# EAGLE design AMS Enerdel Adapter rev7 (EAGLE 9.6.2)
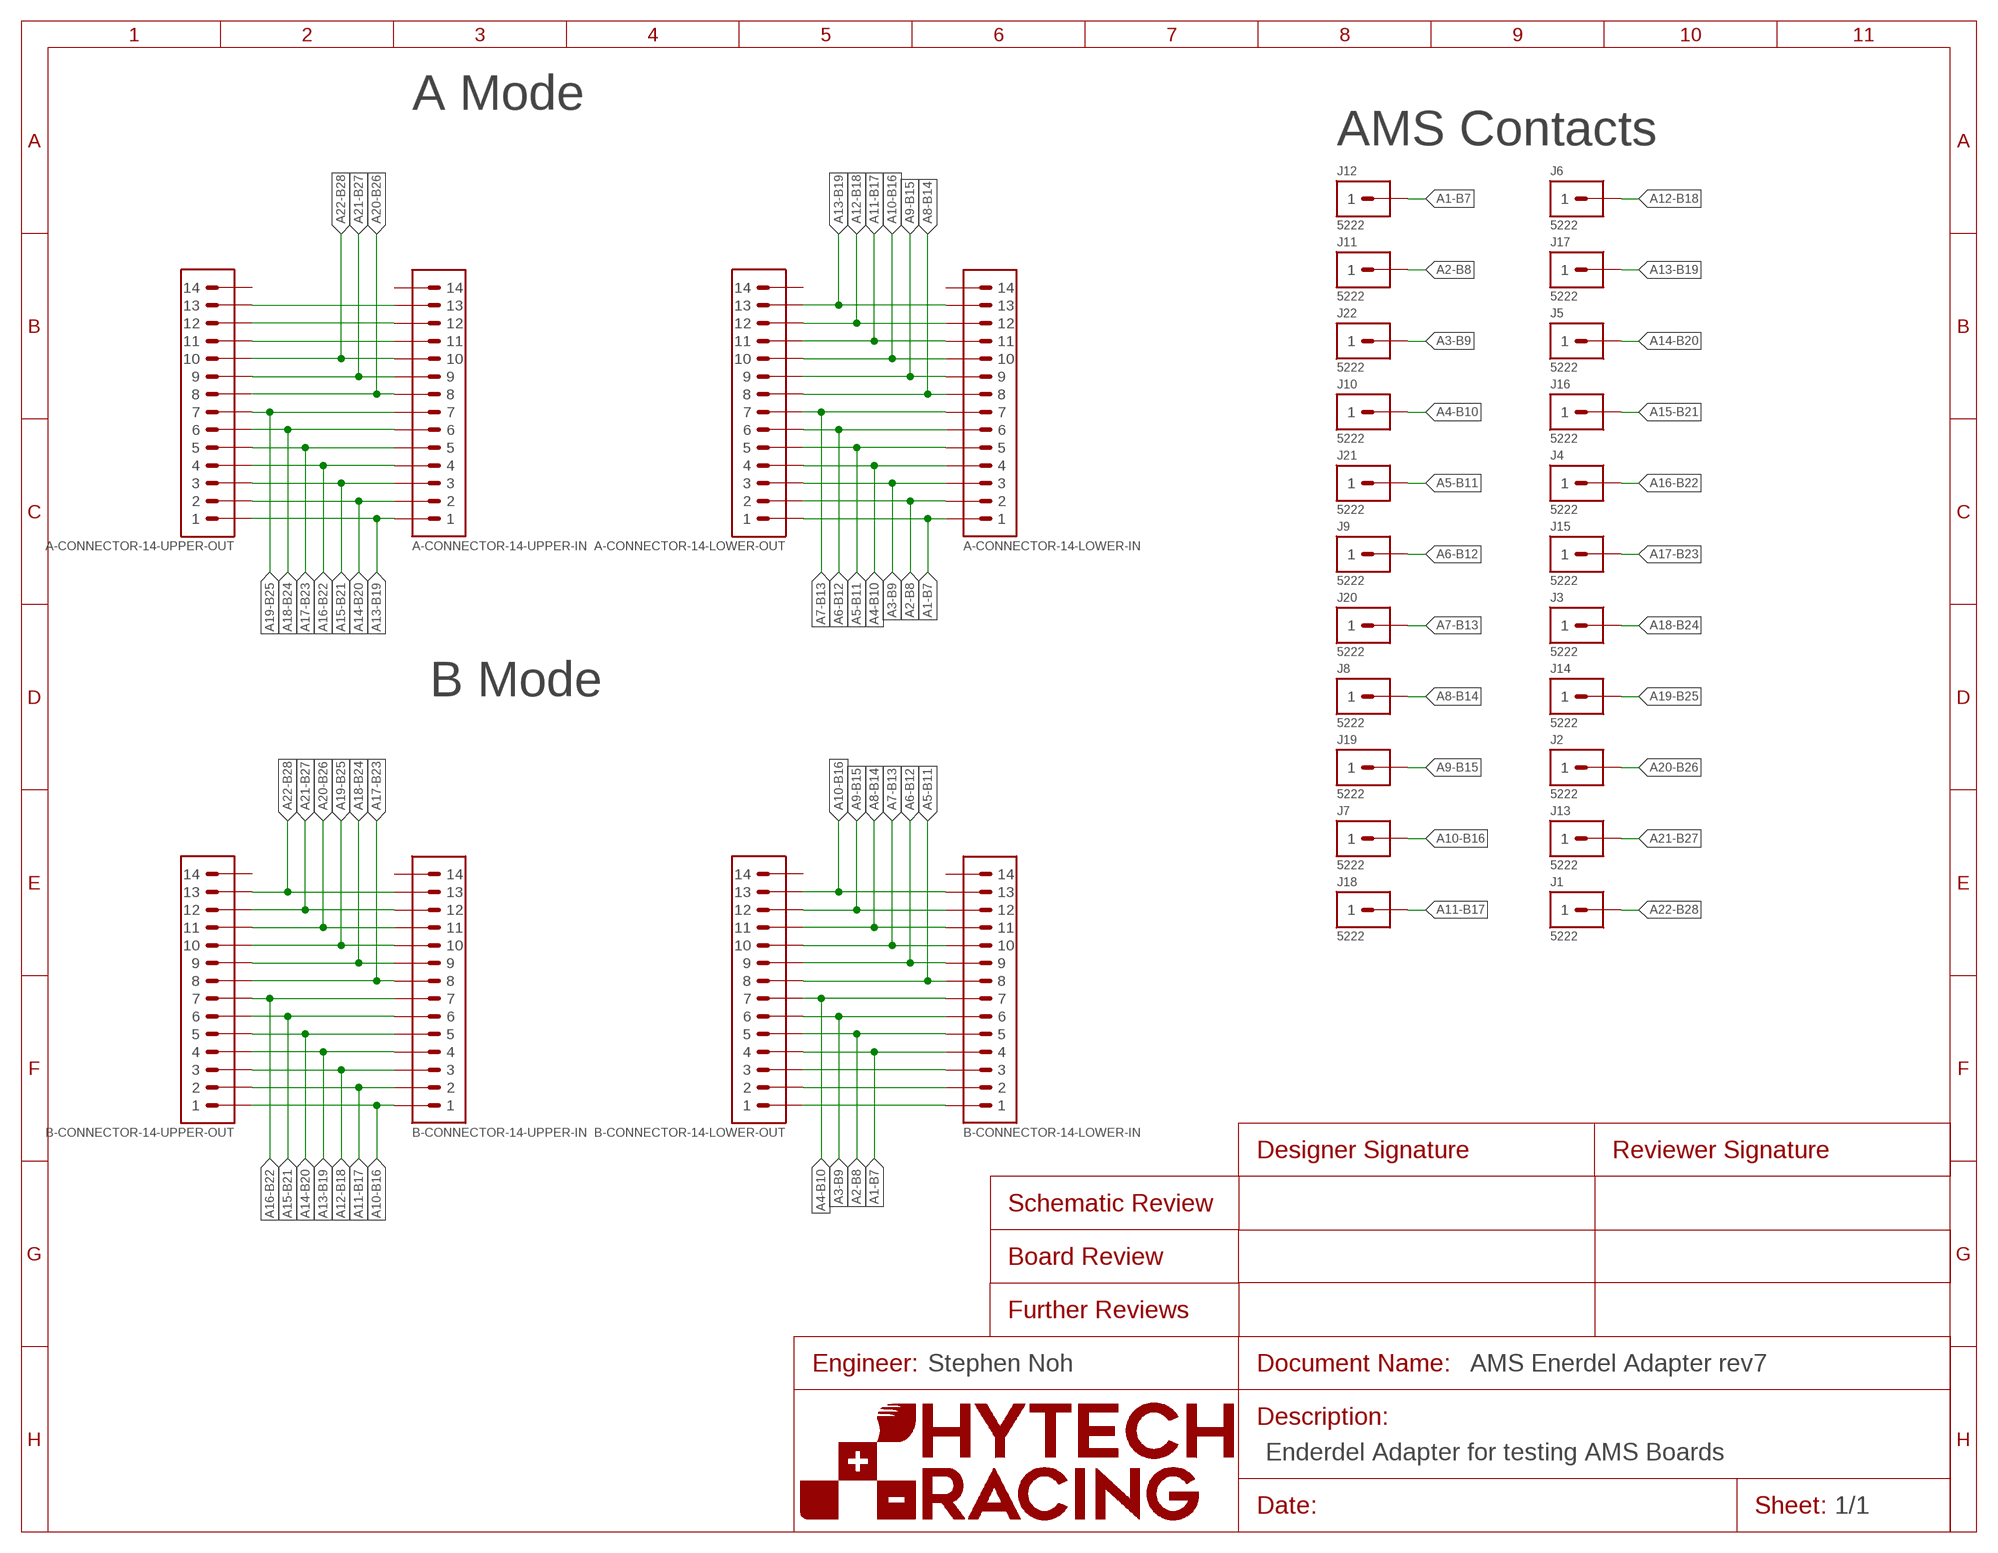
[diagram p0: schematic, sheet 1]

## Parts
A-CONNECTOR-14-LOWER-IN  CONNECTOR-14_MINIFIT_  [MOLEX_MINIFIT_PTH_14]
A-CONNECTOR-14-LOWER-OUT  CONNECTOR-14_MINIFIT_  [MOLEX_MINIFIT_PTH_14]
A-CONNECTOR-14-UPPER-IN  CONNECTOR-14_NANOFIT_  [MOLEX_NANOFIT_PTH_14]
A-CONNECTOR-14-UPPER-OUT  CONNECTOR-14_NANOFIT_  [MOLEX_NANOFIT_PTH_14]
B-CONNECTOR-14-LOWER-IN  CONNECTOR-14_MINIFIT_  [MOLEX_MINIFIT_PTH_14]
B-CONNECTOR-14-LOWER-OUT  CONNECTOR-14_MINIFIT_  [MOLEX_MINIFIT_PTH_14]
B-CONNECTOR-14-UPPER-IN  CONNECTOR-14_NANOFIT_  [MOLEX_NANOFIT_PTH_14]
B-CONNECTOR-14-UPPER-OUT  CONNECTOR-14_NANOFIT_  [MOLEX_NANOFIT_PTH_14]
J1  CONNECTOR-1_5222_  [5222]
J2  CONNECTOR-1_5222_  [5222]
J3  CONNECTOR-1_5222_  [5222]
J4  CONNECTOR-1_5222_  [5222]
J5  CONNECTOR-1_5222_  [5222]
J6  CONNECTOR-1_5222_  [5222]
J7  CONNECTOR-1_5222_  [5222]
J8  CONNECTOR-1_5222_  [5222]
J9  CONNECTOR-1_5222_  [5222]
J10  CONNECTOR-1_5222_  [5222]
J11  CONNECTOR-1_5222_  [5222]
J12  CONNECTOR-1_5222_  [5222]
J13  CONNECTOR-1_5222_  [5222]
J14  CONNECTOR-1_5222_  [5222]
J15  CONNECTOR-1_5222_  [5222]
J16  CONNECTOR-1_5222_  [5222]
J17  CONNECTOR-1_5222_  [5222]
J18  CONNECTOR-1_5222_  [5222]
J19  CONNECTOR-1_5222_  [5222]
J20  CONNECTOR-1_5222_  [5222]
J21  CONNECTOR-1_5222_  [5222]
J22  CONNECTOR-1_5222_  [5222]

## Nets
A1-B7: A-CONNECTOR-14-LOWER-IN.1 A-CONNECTOR-14-LOWER-OUT.1 B-CONNECTOR-14-LOWER-IN.4 B-CONNECTOR-14-LOWER-OUT.4 J12.1
A2-B8: A-CONNECTOR-14-LOWER-IN.2 A-CONNECTOR-14-LOWER-OUT.2 B-CONNECTOR-14-LOWER-IN.5 B-CONNECTOR-14-LOWER-OUT.5 J11.1
A3-B9: A-CONNECTOR-14-LOWER-IN.3 A-CONNECTOR-14-LOWER-OUT.3 B-CONNECTOR-14-LOWER-IN.6 B-CONNECTOR-14-LOWER-OUT.6 J22.1
A4-B10: A-CONNECTOR-14-LOWER-IN.4 A-CONNECTOR-14-LOWER-OUT.4 B-CONNECTOR-14-LOWER-IN.7 B-CONNECTOR-14-LOWER-OUT.7 J10.1
A5-B11: A-CONNECTOR-14-LOWER-IN.5 A-CONNECTOR-14-LOWER-OUT.5 B-CONNECTOR-14-LOWER-IN.8 B-CONNECTOR-14-LOWER-OUT.8 J21.1
A6-B12: A-CONNECTOR-14-LOWER-IN.6 A-CONNECTOR-14-LOWER-OUT.6 B-CONNECTOR-14-LOWER-IN.9 B-CONNECTOR-14-LOWER-OUT.9 J9.1
A7-B13: A-CONNECTOR-14-LOWER-IN.7 A-CONNECTOR-14-LOWER-OUT.7 B-CONNECTOR-14-LOWER-IN.10 B-CONNECTOR-14-LOWER-OUT.10 J20.1
A8-B14: A-CONNECTOR-14-LOWER-IN.8 A-CONNECTOR-14-LOWER-OUT.8 B-CONNECTOR-14-LOWER-IN.11 B-CONNECTOR-14-LOWER-OUT.11 J8.1
A9-B15: A-CONNECTOR-14-LOWER-IN.9 A-CONNECTOR-14-LOWER-OUT.9 B-CONNECTOR-14-LOWER-IN.12 B-CONNECTOR-14-LOWER-OUT.12 J19.1
A10-B16: A-CONNECTOR-14-LOWER-IN.10 A-CONNECTOR-14-LOWER-OUT.10 B-CONNECTOR-14-LOWER-IN.13 B-CONNECTOR-14-LOWER-OUT.13 B-CONNECTOR-14-UPPER-IN.1 B-CONNECTOR-14-UPPER-OUT.1 J7.1
A11-B17: A-CONNECTOR-14-LOWER-IN.11 A-CONNECTOR-14-LOWER-OUT.11 B-CONNECTOR-14-UPPER-IN.2 B-CONNECTOR-14-UPPER-OUT.2 J18.1
A12-B18: A-CONNECTOR-14-LOWER-IN.12 A-CONNECTOR-14-LOWER-OUT.12 B-CONNECTOR-14-UPPER-IN.3 B-CONNECTOR-14-UPPER-OUT.3 J6.1
A13-B19: A-CONNECTOR-14-LOWER-IN.13 A-CONNECTOR-14-LOWER-OUT.13 A-CONNECTOR-14-UPPER-IN.1 A-CONNECTOR-14-UPPER-OUT.1 B-CONNECTOR-14-UPPER-IN.4 B-CONNECTOR-14-UPPER-OUT.4 J17.1
A14-B20: A-CONNECTOR-14-UPPER-IN.2 A-CONNECTOR-14-UPPER-OUT.2 B-CONNECTOR-14-UPPER-IN.5 B-CONNECTOR-14-UPPER-OUT.5 J5.1
A15-B21: A-CONNECTOR-14-UPPER-IN.3 A-CONNECTOR-14-UPPER-OUT.3 B-CONNECTOR-14-UPPER-IN.6 B-CONNECTOR-14-UPPER-OUT.6 J16.1
A16-B22: A-CONNECTOR-14-UPPER-IN.4 A-CONNECTOR-14-UPPER-OUT.4 B-CONNECTOR-14-UPPER-IN.7 B-CONNECTOR-14-UPPER-OUT.7 J4.1
A17-B23: A-CONNECTOR-14-UPPER-IN.5 A-CONNECTOR-14-UPPER-OUT.5 B-CONNECTOR-14-UPPER-IN.8 B-CONNECTOR-14-UPPER-OUT.8 J15.1
A18-B24: A-CONNECTOR-14-UPPER-IN.6 A-CONNECTOR-14-UPPER-OUT.6 B-CONNECTOR-14-UPPER-IN.9 B-CONNECTOR-14-UPPER-OUT.9 J3.1
A19-B25: A-CONNECTOR-14-UPPER-IN.7 A-CONNECTOR-14-UPPER-OUT.7 B-CONNECTOR-14-UPPER-IN.10 B-CONNECTOR-14-UPPER-OUT.10 J14.1
A20-B26: A-CONNECTOR-14-UPPER-IN.8 A-CONNECTOR-14-UPPER-OUT.8 B-CONNECTOR-14-UPPER-IN.11 B-CONNECTOR-14-UPPER-OUT.11 J2.1
A21-B27: A-CONNECTOR-14-UPPER-IN.9 A-CONNECTOR-14-UPPER-OUT.9 B-CONNECTOR-14-UPPER-IN.12 B-CONNECTOR-14-UPPER-OUT.12 J13.1
A22-B28: A-CONNECTOR-14-UPPER-IN.10 A-CONNECTOR-14-UPPER-OUT.10 B-CONNECTOR-14-UPPER-IN.13 B-CONNECTOR-14-UPPER-OUT.13 J1.1
B-PASS1: B-CONNECTOR-14-LOWER-IN.3 B-CONNECTOR-14-LOWER-OUT.3
B-PASS2: B-CONNECTOR-14-LOWER-IN.2 B-CONNECTOR-14-LOWER-OUT.2
B-PASS3: B-CONNECTOR-14-LOWER-IN.1 B-CONNECTOR-14-LOWER-OUT.1
N$5: A-CONNECTOR-14-UPPER-IN.11 A-CONNECTOR-14-UPPER-OUT.11
N$6: A-CONNECTOR-14-UPPER-IN.12 A-CONNECTOR-14-UPPER-OUT.12
N$7: A-CONNECTOR-14-UPPER-IN.13 A-CONNECTOR-14-UPPER-OUT.13
Unconnected: A-CONNECTOR-14-LOWER-IN.14 A-CONNECTOR-14-LOWER-OUT.14 A-CONNECTOR-14-UPPER-IN.14 A-CONNECTOR-14-UPPER-OUT.14 B-CONNECTOR-14-LOWER-IN.14 B-CONNECTOR-14-LOWER-OUT.14 B-CONNECTOR-14-UPPER-IN.14 B-CONNECTOR-14-UPPER-OUT.14

## Notes on the sheet
- A Mode
- AMS Contacts
- B Mode
- Stephen Noh
- Enderdel Adapter for testing AMS Boards

## Library data of the parts
A-CONNECTOR-14-LOWER-IN A-CONNECTOR-14-LOWER-OUT A-CONNECTOR-14-UPPER-IN A-CONNECTOR-14-UPPER-OUT B-CONNECTOR-14-LOWER-IN B-CONNECTOR-14-LOWER-OUT B-CONNECTOR-14-UPPER-IN B-CONNECTOR-14-UPPER-OUT = HyTechDevices:CONNECTOR-14_?_*
J1-J22 = HyTechDevices:CONNECTOR-1_?_*: 1 Pin Connector Pogo pin datasheet <https://www.mouser.com/datasheet/2/273/Mill-Max_03212019_807-22-001-10-020101-1545127.pdf> 5222 Spring datasheet <https://www.mouser.com/datasheet/2/215/5222-743174.pdf>; DKPN: 36-5222-ND; MANUFACTURER: Keystone Electronics; MODEL: SPRING; MOPN: 534-5222; MPN: 5222

## Board
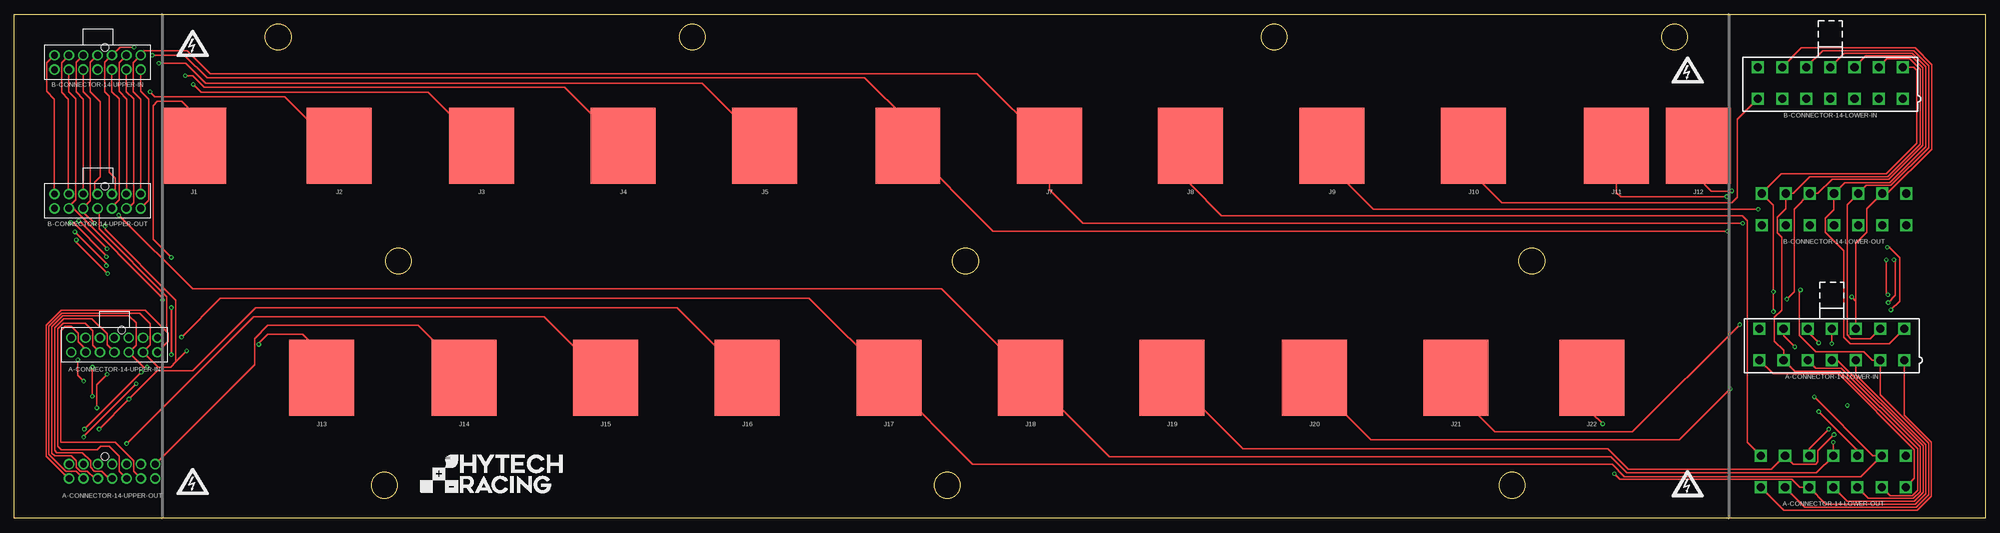
[diagram p1: board, top side]
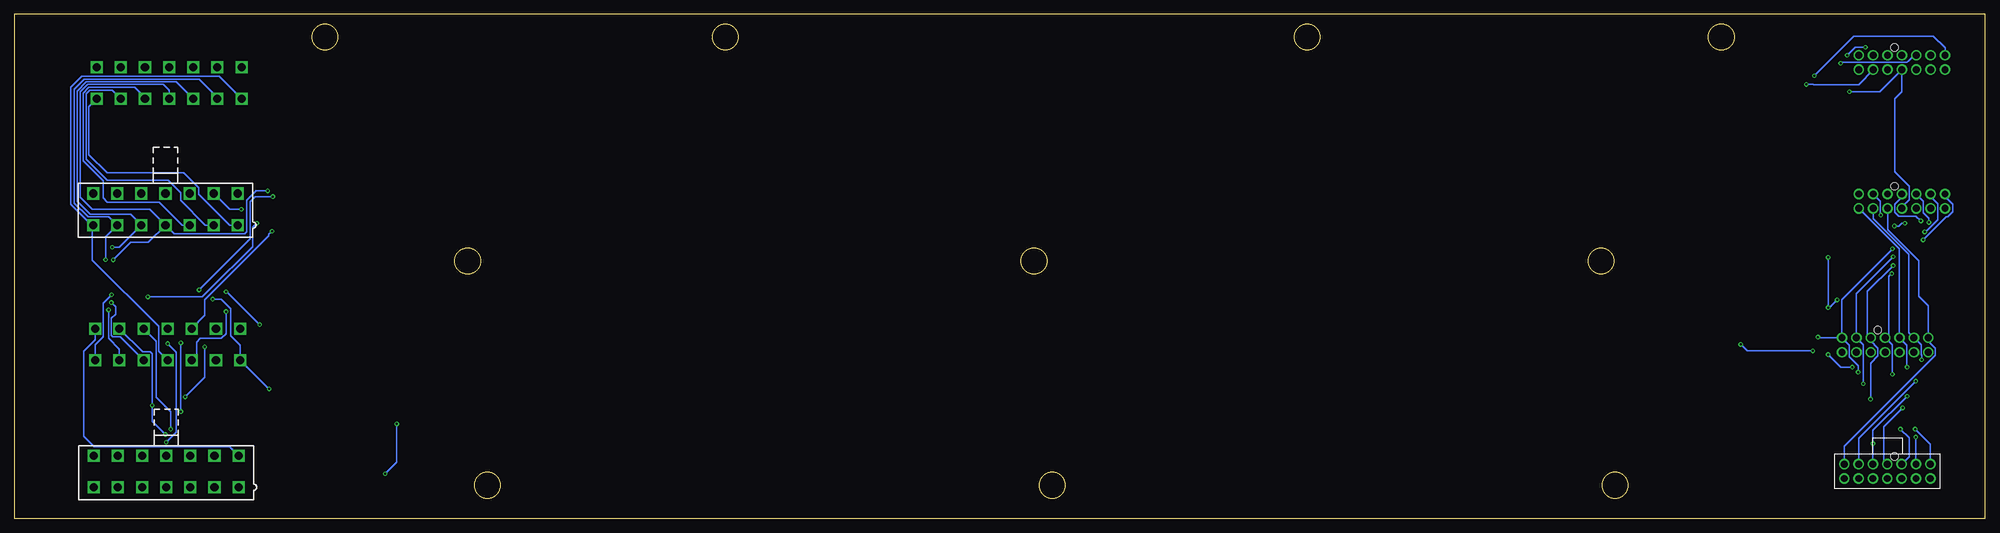
[diagram p2: board, bottom side, seen from below]

Size 342.9 x 87.63 mm. Coordinates in mm from the lower left corner, seen from the top.
Outline: 0,0 0,87.63 342.9,87.63 342.9,0 0,0
Outline: circle at 117.98,83.69 radius 2.25
Outline: circle at 219.2,83.69 radius 2.25
Outline: circle at 288.85,83.69 radius 2.25
Outline: circle at 66.8,44.7 radius 2.25
Outline: circle at 45.9,83.69 radius 2.25
Outline: circle at 165.48,44.7 radius 2.25
Outline: circle at 264.03,44.7 radius 2.25
Outline: circle at 260.6,5.71 radius 2.25
Outline: circle at 162.31,5.71 radius 2.25
Outline: circle at 64.39,5.71 radius 2.25
Copper layers (1*16): Top 0.035mm / dielectric 1.53mm / Bottom 0.035mm
Design rules "HyTech Default (2 Layer)": minimum track width 8mil, minimum drill 0.3mm, track to track 8mil, track to pad 8mil, pad to pad 8mil, via to via 22mil, smd to smd 8mil, copper to edge 17mil, drill to drill 23mil, minimum pad ring 9mil, minimum via ring 8mil, stop-mask expansion 8mil, vias tented up to drill 30mil, thermal gap 10mil

### Footprints (pad centres in the part's own frame; a part is rotated, then mirrored left to right if it is on the bottom)
MOLEX_MINIFIT_PTH_14 = drill 1.4 square: 1 12.6,-2.75; 2 8.4,-2.75; 3 4.2,-2.75; 4 0,-2.75; 5 -4.2,-2.75; 6 -8.4,-2.75; 7 -12.6,-2.75; 8 12.6,2.75; 9 8.4,2.75; 10 4.2,2.75; 11 0,2.75; 12 -4.2,2.75; 13 -8.4,2.75; 14 -12.6,2.75
MOLEX_NANOFIT_PTH_14 = drill 1.2: 1 7.5,0; 2 5,0; 3 2.5,0; 4 0,0; 5 -2.5,0; 6 -5,0; 7 -7.5,0; 8 7.5,-2.5; 9 5,-2.5; 10 2.5,-2.5; 11 0,-2.5; 12 -2.5,-2.5; 13 -5,-2.5; 14 -7.5,-2.5 | hole 1.3: 1.27,1.34
5222 = smd 11.303 x 13.208: 1 0,0

### Placement (x,y rotation side)
A-CONNECTOR-14-LOWER-IN  316.23,30.23 0 top
A-CONNECTOR-14-LOWER-OUT  316.48,8.13 0 bottom
A-CONNECTOR-14-UPPER-IN  17.4,31.37 0 top
A-CONNECTOR-14-UPPER-OUT  17.02,9.4 0 bottom
B-CONNECTOR-14-LOWER-IN  315.98,75.69 0 top
B-CONNECTOR-14-LOWER-OUT  316.61,53.72 0 bottom
B-CONNECTOR-14-UPPER-IN  14.48,80.52 0 top
B-CONNECTOR-14-UPPER-OUT  14.48,56.39 0 top
J1  31.24,64.77 180 top
J2  56.52,64.77 180 top
J3  81.28,64.77 180 top
J4  105.92,64.77 180 top
J5  130.56,64.77 180 top
J6  155.45,64.77 180 top
J7  180.09,64.77 180 top
J8  204.6,64.77 180 top
J9  229.24,64.77 180 top
J10  253.87,64.77 180 top
J11  278.76,64.77 180 top
J12  292.99,64.77 180 top
J13  53.47,24.38 180 top
J14  78.23,24.38 180 top
J15  102.87,24.38 180 top
J16  127.51,24.38 180 top
J17  152.15,24.38 180 top
J18  176.78,24.38 180 top
J19  201.42,24.38 180 top
J20  226.19,24.38 180 top
J21  250.83,24.38 180 top
J22  274.45,24.38 180 top
U$1  [HV_0.50"]  31.04,82.6 0 top
U$2  [HV_0.50"]  291.13,77.95 0 top
U$3  [HV_0.50"]  31.04,6.4 0 top
U$4  [HV_0.50"]  291.13,5.99 0 top
U$5  [LOGO_HYTECH_1.0"]  70.28,4.06 0 top

### Tracks (layer width: path | path; a pad name or v marks a point on that pad's centre or on a via)
A1-B7  (via drill 0.35)
  Top 0.254: A-CONNECTOR-14-LOWER-OUT.1 303.88,5.36 307.85,1.4 331.09,1.4 333.53,3.83 333.53,13.23 328.83,17.93 A-CONNECTOR-14-LOWER-IN.1 | J12.1 292.99,59.18 295.27,56.9 298.81,56.9 v298.83,56.92 | v325.7,44.93 325.7,39.14 v325.98,38.86
  Bottom 0.254: B-CONNECTOR-14-LOWER-IN.4 315.98,74.42 316.99,75.44 330.13,75.44 331.44,74.13 331.44,55.85 329.31,53.72 319.36,53.72 B-CONNECTOR-14-LOWER-OUT.4 | A-CONNECTOR-14-LOWER-IN.1 328.83,30.16 327.45,31.54 327.45,37.4 v325.98,38.86 | B-CONNECTOR-14-LOWER-OUT.4 319.58,48.01 322.63,48.01 v325.7,44.93 | B-CONNECTOR-14-LOWER-OUT.4 315.08,49.44 302.86,49.44 302.49,49.81 302.49,55.27 300.84,56.92 v298.83,56.92
A2-B8  (via drill 0.35)
  Top 0.254: A-CONNECTOR-14-LOWER-OUT.2 308.08,5.35 311.53,1.91 330.94,1.91 333.07,4.04 333.07,12.99 324.63,21.43 A-CONNECTOR-14-LOWER-IN.2 323.23,27.48 321.75,28.96 313.43,28.96 310.57,31.83 310.57,39.5 v310.77,39.7 | v326.52,36.22 328.02,37.72 328.02,45.31 326.21,47.12 v325.88,47.12 | J11.1 278.76,56.64 279.48,55.93 v297.92,55.93
  Bottom 0.254: B-CONNECTOR-14-LOWER-IN.5 314.73,75.89 330.38,75.89 331.98,74.29 331.98,55.12 329.72,52.86 322.7,52.86 B-CONNECTOR-14-LOWER-OUT.5 324.66,47.12 v325.88,47.12 | A-CONNECTOR-14-LOWER-IN.2 324.63,29.4 326.52,31.28 v326.52,36.22 | v310.77,39.7 301.9,48.56 301.9,55.07 301.04,55.93 v297.92,55.93
A3-B9  (via drill 0.35)
  Top 0.254: A-CONNECTOR-14-LOWER-IN.3 320.43,24.91 332.61,12.73 332.61,4.27 330.76,2.41 315.21,2.41 312.28,5.34 A-CONNECTOR-14-LOWER-OUT.3 310.68,5.38 309.3,6.76 279.35,6.76 v278.38,7.72 | v326.03,37.49 327.28,38.73 327.28,44.7 v327.02,44.96 | J22.1 274.45,18.29 v276.35,16.38
  Bottom 0.254: B-CONNECTOR-14-LOWER-IN.6 307.58,73.24 310.72,76.38 330.72,76.38 332.46,74.63 332.46,54.79 330.06,52.4 326.44,52.4 B-CONNECTOR-14-LOWER-OUT.6 327.02,48.96 v327.02,44.96 | A-CONNECTOR-14-LOWER-IN.3 324.47,31.52 325.77,31.52 326.03,31.78 326.03,34.75 325.27,35.51 325.27,36.73 v326.03,37.49 | v278.38,7.72 276.35,9.76 v276.35,16.38
A4-B10
  Top 0.254: A-CONNECTOR-14-LOWER-IN.4 317.19,27.48 332.1,12.57 332.1,4.47 330.56,2.92 318.9,2.92 316.48,5.33 A-CONNECTOR-14-LOWER-OUT.4 | J10.1 253.87,59.82 258.83,54.86 298.83,54.86 299.82,55.85 299.82,69.39 B-CONNECTOR-14-LOWER-IN.7
  Bottom 0.254: B-CONNECTOR-14-LOWER-IN.7 307.29,76.86 331.14,76.86 333.07,74.93 333.07,54.6 329.44,50.97 B-CONNECTOR-14-LOWER-OUT.7 329.31,50.87 329.31,44.86 317.79,33.34 317.79,29.03 A-CONNECTOR-14-LOWER-IN.4
A5-B11  (via drill 0.35)
  Top 0.254: A-CONNECTOR-14-LOWER-IN.5 313.43,26.08 317.9,26.08 331.6,12.38 331.6,4.62 330.4,3.43 322.58,3.43 320.68,5.32 A-CONNECTOR-14-LOWER-OUT.5 | v306.07,35.94 v306.07,39.37 306.07,54.41 B-CONNECTOR-14-LOWER-OUT.8 307.43,59.89 325.7,59.89 331.04,65.23 331.04,77.88 330.47,78.44 B-CONNECTOR-14-LOWER-IN.8 | J21.1 250.83,21.72 257.56,14.99 281.56,14.99 v300.23,33.65
  Bottom 0.254: A-CONNECTOR-14-LOWER-IN.5 311.17,28.33 311.17,30.62 310.53,31.27 306.92,31.27 306.07,32.11 v306.07,35.94
  Bottom 0.305: v300.23,33.65 305.94,39.37 v306.07,39.37
A6-B12  (via drill 0.35)
  Top 0.254: A-CONNECTOR-14-LOWER-OUT.6 324.88,5.44 326.39,3.94 330.22,3.94 331.14,4.85 331.14,12.06 317.64,25.56 309.74,25.56 A-CONNECTOR-14-LOWER-IN.6 307.83,29.21 306.25,30.79 306.25,34.9 307.49,36.15 307.49,48.89 306.73,49.65 306.73,52.36 308.21,53.85 B-CONNECTOR-14-LOWER-OUT.9 309.48,56.47 312.41,59.4 325.92,59.4 331.6,65.07 331.6,78.1 329.82,79.88 325.82,79.88 B-CONNECTOR-14-LOWER-IN.9 | J9.1 229.24,60.96 236.47,53.72 v303.4,53.72
  Bottom 0.254: B-CONNECTOR-14-LOWER-OUT.9 305.46,53.72 v303.4,53.72
A7-B13  (via drill 0.35)
  Top 0.254: A-CONNECTOR-14-LOWER-OUT.7 330.61,6.9 330.61,11.94 317.44,25.1 306,25.1 A-CONNECTOR-14-LOWER-IN.7 | B-CONNECTOR-14-LOWER-IN.10 322.12,80.39 330.01,80.39 332.08,78.32 332.08,64.87 326.15,58.94 316.28,58.94 313.81,56.47 B-CONNECTOR-14-LOWER-OUT.10 309.69,53.75 309.69,39.39 v308.4,38.1 | J20.1 226.19,23.49 236.06,13.62 289.71,13.62 v298.58,22.48
  Bottom 0.254: v308.4,38.1 306.94,38.1 305.28,36.44 305.28,31.75 303.63,30.1 A-CONNECTOR-14-LOWER-IN.7 298.63,22.48 v298.58,22.48
A8-B14
  Top 0.254: B-CONNECTOR-14-LOWER-IN.11 315.98,78.46 318.39,80.87 330.22,80.87 332.61,78.49 332.61,64.64 326.35,58.38 318.52,58.38 B-CONNECTOR-14-LOWER-OUT.11 316.61,53.67 315.1,52.16 315.1,49.7 318.32,46.49 318.32,31.44 319.4,30.35 326.21,30.35 A-CONNECTOR-14-LOWER-IN.8 | J8.1 204.6,58.04 210.06,52.58 300.69,52.58 301.52,51.74 301.52,13.24 A-CONNECTOR-14-LOWER-OUT.8
  Bottom 0.254: A-CONNECTOR-14-LOWER-IN.8 328.83,31.04 330.79,29.07 330.79,14.27 328.97,12.45 305.4,12.45 303.88,10.94 A-CONNECTOR-14-LOWER-OUT.8
A9-B15  (via drill 0.35)
  Top 0.254: B-CONNECTOR-14-LOWER-IN.12 311.78,78.48 314.63,81.33 330.48,81.33 333.1,78.72 333.1,64.44 326.53,57.87 322.21,57.87 B-CONNECTOR-14-LOWER-OUT.12 318.9,54.56 318.9,31.89 319.54,31.24 322.9,31.24 A-CONNECTOR-14-LOWER-IN.9 | J19.1 213.74,12.06 277.24,12.06 280.8,8.51 305.71,8.51 A-CONNECTOR-14-LOWER-OUT.9 308.08,10.81 309.5,9.4 313.44,9.4 313.82,9.78 313.82,11.73 v316.61,14.53
  Bottom 0.254: A-CONNECTOR-14-LOWER-IN.9 320.59,28.93 319.29,28.93 318.92,28.56 v318.92,19.62 318.92,16.84 v316.61,14.53
A10-B16  (via drill 0.35)
  Top 0.254: B-CONNECTOR-14-UPPER-OUT.1 21.98,72.9 20.72,74.16 20.72,79.26 B-CONNECTOR-14-UPPER-IN.1 22.1,80.64 22.1,80.77 22.61,81.28 30.11,81.28 34.04,77.34 167.51,77.34 J7.1 180.09,57.15 185.93,51.31 v300.71,51.31 | A-CONNECTOR-14-LOWER-OUT.10 312.28,12.06 315.69,15.46 v315.69,15.49 | B-CONNECTOR-14-LOWER-IN.13 310.92,81.79 330.71,81.79 333.63,78.87 333.63,64.2 325.9,56.47 B-CONNECTOR-14-LOWER-OUT.13 322.34,53.8 322.34,49.73 320.43,47.81 320.43,37.72 | 320.43,37.72 A-CONNECTOR-14-LOWER-IN.10 | 320.43,37.72 v319.67,38.48 v319.66,38.48
  Bottom 0.254: A-CONNECTOR-14-LOWER-IN.10 318.26,30.81 318.26,21.04 315.69,18.47 v315.69,15.49 | v319.66,38.48 310.18,38.48 308.97,39.7 308.97,39.71 301.45,47.23 301.45,50.57 v300.71,51.31
A11-B17  (via drill 0.35)
  Top 0.254: B-CONNECTOR-14-UPPER-OUT.2 19.56,56.47 19.56,72.9 18.21,74.24 18.21,79.25 B-CONNECTOR-14-UPPER-IN.2 | A-CONNECTOR-14-LOWER-IN.11 v316.23,30.35 | v316.48,13.21 A-CONNECTOR-14-LOWER-OUT.11 316.48,10.8 313.56,7.87 280.54,7.87 277.75,10.67 190.5,10.67 J18.1 161.29,39.88 30.99,39.88 v18.16,52.7
  Bottom 0.254: v316.23,30.35 314.77,28.9 314.77,14.92 v316.48,13.21 | v18.16,52.7 18.21,52.76 18.21,55.12 B-CONNECTOR-14-UPPER-OUT.2
A12-B18  (via drill 0.35)
  Top 0.254: B-CONNECTOR-14-UPPER-OUT.3 16.98,56.42 17.54,56.98 17.54,59.11 16.51,60.14 16.51,73.41 15.72,74.19 15.72,79.26 B-CONNECTOR-14-UPPER-IN.3 18.38,81.91 v20.83,81.91 | v313.94,30.48 312.03,32.39 A-CONNECTOR-14-LOWER-IN.12 | v313.94,18.54 313.94,18.51 320.68,11.77 A-CONNECTOR-14-LOWER-OUT.12 | v298.07,49.91 170.31,49.91 J6.1 155.45,69.09 147.96,76.58 33.53,76.58 29.59,80.52 v24,80.52
  Bottom 0.254: v313.94,30.48 v313.94,18.54 | A-CONNECTOR-14-LOWER-IN.12 309.75,35.25 309.75,37.98 298.63,49.11 298.63,49.35 v298.07,49.91 | v24,80.52 22.61,81.91 v20.83,81.91
A13-B19  (via drill 0.35)
  Top 0.254: B-CONNECTOR-14-UPPER-OUT.4 13.95,56.91 13.95,58.47 14.91,59.42 14.91,72.47 13.23,74.14 13.23,79.27 B-CONNECTOR-14-UPPER-IN.4 | v313.18,21.08 323.39,10.88 A-CONNECTOR-14-LOWER-OUT.13 321.25,7.24 280.16,7.24 278,9.4 166.75,9.4 152.15,24 J17.1 138.3,38.23 35.81,38.23 v29.08,31.5 | A-CONNECTOR-14-LOWER-IN.13 307.83,31.74 v309.78,29.79 | v11.18,51.69 11.3,51.69 v16.13,46.86 | v12.19,15.49 v22.1,25.4
  Bottom 0.254: A-CONNECTOR-14-UPPER-OUT.1 9.57,9.45 9.57,12.87 v12.19,15.49 | v22.1,25.4 22.1,26.54 23.63,28.08 23.63,30.1 A-CONNECTOR-14-UPPER-IN.1 | v309.78,29.79 309.78,24.49 v313.18,21.08 | A-CONNECTOR-14-UPPER-IN.1 24.9,37.97 16.13,46.74 v16.13,46.86 | v11.18,51.69 12.04,52.56 15.04,52.56 15.71,53.22 15.71,54.58 14.48,55.81 B-CONNECTOR-14-UPPER-OUT.4 | v29.08,31.5 28.96,31.37 A-CONNECTOR-14-UPPER-IN.1
A14-B20  (via drill 0.35)
  Top 0.254: B-CONNECTOR-14-UPPER-IN.5 10.74,79.28 10.74,74.13 11.98,72.9 B-CONNECTOR-14-UPPER-OUT.5 | v12.06,14.1 12.06,14.22 v21.21,23.37 | v16,45.47 16,45.64 10.21,51.43 v9.78,51.43 | J5.1 119.63,75.69 33.27,75.69 29.84,79.12 v25.15,79.12
  Bottom 0.254: v12.06,14.1 12.06,9.44 A-CONNECTOR-14-UPPER-OUT.2 | v21.21,23.37 21.16,23.42 21.16,30.13 A-CONNECTOR-14-UPPER-IN.2 22.4,39.07 v16,45.47 | v9.78,51.43 9.78,52.19 10.73,53.14 10.73,55.14 B-CONNECTOR-14-UPPER-OUT.5 | B-CONNECTOR-14-UPPER-IN.5 12.35,80.52 13.41,79.45 13.61,79.26 25,79.26 v25.15,79.12
A15-B21  (via drill 0.35)
  Top 0.254: B-CONNECTOR-14-UPPER-OUT.6 9.4,56.47 9.4,72.9 8.21,74.09 8.21,79.25 B-CONNECTOR-14-UPPER-IN.6 | v14.73,15.49 v19.94,20.7 24.87,25.63 31,25.63 41.95,36.58 115.32,36.58 J16.1 | v10.54,49.78 16,44.32 v16,43.94
  Bottom 0.254: A-CONNECTOR-14-UPPER-OUT.3 13.21,10.71 13.21,13.97 v14.73,15.49 | v19.94,20.7 19.94,26.93 18.64,28.23 18.64,29.59 19.9,30.84 A-CONNECTOR-14-UPPER-IN.3 19.9,31.4 20.46,31.97 20.46,39.48 v16,43.94 | B-CONNECTOR-14-UPPER-OUT.6 9.48,55.91 8.22,54.66 8.22,51.88 10.32,49.78 v10.54,49.78
A16-B22  (via drill 0.35)
  Top 0.254: B-CONNECTOR-14-UPPER-IN.7 5.65,79.19 5.65,74.23 6.98,72.9 B-CONNECTOR-14-UPPER-OUT.7 | v14.35,19.18 14.35,23.24 v16.13,25.02 | v16.26,42.54 10.79,48.01 v10.79,48.39 | J4.1 95.76,74.93 33.02,74.93 30.99,76.96 v29.72,76.96
  Bottom 0.254: A-CONNECTOR-14-UPPER-OUT.4 17.65,10.03 17.65,15.88 v14.35,19.18 | v16.13,25.02 16.13,25.04 16.15,25.07 16.15,30.12 A-CONNECTOR-14-UPPER-IN.4 16.76,32 16.76,42.04 v16.26,42.54 | v10.79,48.39 10.79,48.41 6.75,52.45 6.49,52.45 5.65,53.3 5.65,54.6 6.98,55.94 B-CONNECTOR-14-UPPER-OUT.7 | v29.72,76.96 22.86,83.82 9.02,83.82 6.98,81.78 B-CONNECTOR-14-UPPER-IN.7
A17-B23  (via drill 0.35)
  Top 0.254: B-CONNECTOR-14-UPPER-IN.8 21.98,74.29 23.37,72.9 23.37,55.28 B-CONNECTOR-14-UPPER-OUT.8 | v13.59,21.21 v13.59,26.29 | J15.1 92.2,35.05 41.62,35.05 v19.52,12.95
  Bottom 0.254: A-CONNECTOR-14-UPPER-OUT.5 v19.52,12.95 19.52,15.28 v13.59,21.21 | v13.59,26.29 13.64,26.34 13.64,30.11 A-CONNECTOR-14-UPPER-IN.5 14.9,46.82 B-CONNECTOR-14-UPPER-OUT.8
A18-B24  (via drill 0.35)
  Top 0.254: B-CONNECTOR-14-UPPER-OUT.9 19.73,53.89 20.72,54.88 20.72,72.92 19.48,74.17 B-CONNECTOR-14-UPPER-IN.9 | v12.06,23.82 11.05,24.84 v11.05,27.56 | J3.1 72.01,74.04 32.51,74.04 v31.11,75.44
  Bottom 0.254: A-CONNECTOR-14-UPPER-OUT.6 22.02,13.87 v12.06,23.82 | v11.05,27.56 11.05,28.35 11.15,28.46 11.15,30.12 A-CONNECTOR-14-UPPER-IN.6 13.29,32.26 13.29,45.86 19.48,52.05 B-CONNECTOR-14-UPPER-OUT.9 | v31.11,75.44 29.89,75.44 29.87,75.41 22.02,75.41 19.48,77.96 B-CONNECTOR-14-UPPER-IN.9
A19-B25
  Top 0.254: B-CONNECTOR-14-UPPER-IN.10 16.98,74.21 18.23,72.95 18.23,55.37 16.98,54.11 B-CONNECTOR-14-UPPER-OUT.10 | J14.1 78.23,25.53 70.23,33.53 44.07,33.53 41.78,31.24 41.78,26.66 A-CONNECTOR-14-UPPER-OUT.7
  Bottom 0.254: A-CONNECTOR-14-UPPER-OUT.7 24.52,12.48 8.67,28.33 8.67,29.56 9.9,30.79 A-CONNECTOR-14-UPPER-IN.7 9.9,36.95 11.56,38.61 11.56,44.78 16.98,50.2 B-CONNECTOR-14-UPPER-OUT.10
A20-B26  (via drill 0.35)
  Top 0.254: A-CONNECTOR-14-UPPER-OUT.8 9.39,6.9 5.51,10.78 5.51,33.58 8.13,36.19 22.73,36.19 26.54,32.38 | A-CONNECTOR-14-UPPER-IN.8 26.8,30.77 26.8,32.13 26.54,32.38 | 26.54,32.38 26.54,38.51 14.73,50.32 14.73,53.63 B-CONNECTOR-14-UPPER-OUT.11 | J2.1 55.5,64.77 46.99,73.28 24.38,73.28 23.62,74.04 v23.62,74.17
  Bottom 0.254: B-CONNECTOR-14-UPPER-IN.11 14.48,77.98 | 14.48,77.98 14.48,74.21 15.75,72.94 15.75,60.26 13.22,57.74 13.22,55.4 14.48,54.14 B-CONNECTOR-14-UPPER-OUT.11 | v23.62,74.17 18.29,74.17 14.48,77.98
A21-B27  (via drill 0.35)
  Top 0.254: B-CONNECTOR-14-UPPER-IN.12 11.98,74.21 13.23,72.95 13.23,55.22 12,53.99 12,53.91 | A-CONNECTOR-14-UPPER-OUT.9 10.75,8.17 8.95,8.17 5.99,11.13 5.99,33.41 8.25,35.66 21.8,35.66 23.65,33.81 23.65,30.12 A-CONNECTOR-14-UPPER-IN.9 22.42,28.87 25,26.29 27.18,26.29 28.07,27.18 | J13.1 53.47,28.7 50.16,32 44.09,32 42.55,30.45 v42.55,30.23 | 28.07,27.18 28.07,37.93 15.77,50.22 v15.77,50.82 | 12,53.91 B-CONNECTOR-14-UPPER-OUT.12 | 12,53.91 12,53.23 v13.95,51.28 | v29.97,29.08 28.07,27.18
  Bottom 0.254: v13.95,51.28 14.54,51.28 15.01,50.82 v15.77,50.82 | v42.55,30.23 41.4,29.08 v29.97,29.08
A22-B28  (via drill 0.35)
  Top 0.254: B-CONNECTOR-14-UPPER-IN.13 9.48,74.21 10.71,72.98 10.71,55.42 9.48,54.19 B-CONNECTOR-14-UPPER-OUT.13 10.23,53.89 25.75,38.37 v25.75,37.97 | 19.94,28.83 A-CONNECTOR-14-UPPER-IN.10 | A-CONNECTOR-14-UPPER-OUT.10 13.96,6.9 12.71,8.15 11.47,8.15 10.75,8.87 10.75,9.96 9.88,10.83 6.99,10.83 6.53,11.3 6.53,33.27 8.43,35.18 19.94,35.18 21.16,33.96 21.16,30.05 19.94,28.83 | J1.1 31.24,70.36 29.08,72.52 24.89,72.52 24.13,71.75 24.13,48.51 v27.3,45.34 | v23.11,26.29 22.48,26.29 19.94,28.83
  Top 0.305: v27.3,36.64 v27.3,28.45
  Bottom 0.254: v23.11,26.29 25.15,26.29 v27.3,28.45 | v27.3,45.34 v27.3,36.64 27.08,36.64 v25.75,37.97
B-PASS1
  Bottom 0.254: B-CONNECTOR-14-LOWER-OUT.3 313.68,50.97 317.7,54.99 326.77,54.99 327.47,55.69 327.47,58.68 330.96,62.17 330.96,73.91 329.92,74.95 322,74.95 320.18,73.14 B-CONNECTOR-14-LOWER-IN.3
B-PASS2
  Bottom 0.254: B-CONNECTOR-14-LOWER-OUT.2 309.66,50.97 313.99,55.3 313.99,56.63 316.17,58.8 326.77,58.8 330.43,62.46 330.43,73.79 329.79,74.42 325.86,74.42 B-CONNECTOR-14-LOWER-IN.2
B-PASS3
  Bottom 0.254: B-CONNECTOR-14-LOWER-OUT.1 305.41,50.97 310.81,56.37 310.81,57.47 313.41,60.07 326.77,60.07 329.95,63.25 329.95,71.57 B-CONNECTOR-14-LOWER-IN.1
N$5
  Top 0.254: A-CONNECTOR-14-UPPER-OUT.11 16.44,6.9 15.18,8.15 13.92,8.15 13.25,8.82 13.25,9.99 11.85,11.39 7.41,11.39 6.98,11.81 6.98,33.08 8.58,34.67 13.49,34.67 16.13,32.03 16.13,30.14 A-CONNECTOR-14-UPPER-IN.11
N$6
  Top 0.254: A-CONNECTOR-14-UPPER-OUT.12 18.25,8.17 18.25,10.77 16.49,12.53 15,12.53 14.41,11.94 8.13,11.94 7.52,12.55 7.52,32.92 8.51,33.91 12.32,33.91 13.67,32.56 13.67,30.1 A-CONNECTOR-14-UPPER-IN.12
N$7
  Top 0.254: A-CONNECTOR-14-UPPER-OUT.13 20.75,8.17 20.75,10.01 17.55,13.21 8.13,13.21 8.05,13.28 8.05,32.64 8.81,33.4 9.88,33.4 11.14,32.14 11.14,30.65 12.4,29.4 A-CONNECTOR-14-UPPER-IN.13

### Text on the board
tDocu: DANGER HIGH VOLTAGE | Mode B | Mode B | Warning: DO NOT MIX Mode A and Mode B! Use only one mode at a time. | Warning: DO NOT MIX Mode A and Mode B! Use only one mode at a time. | Mode A | Mode A | Enerdel Adapter Rev 7 / Designed by Stephen Noh | DANGER HIGH VOLTAGE